# EAGLE schematic Fridge (EAGLE 9.7.0)
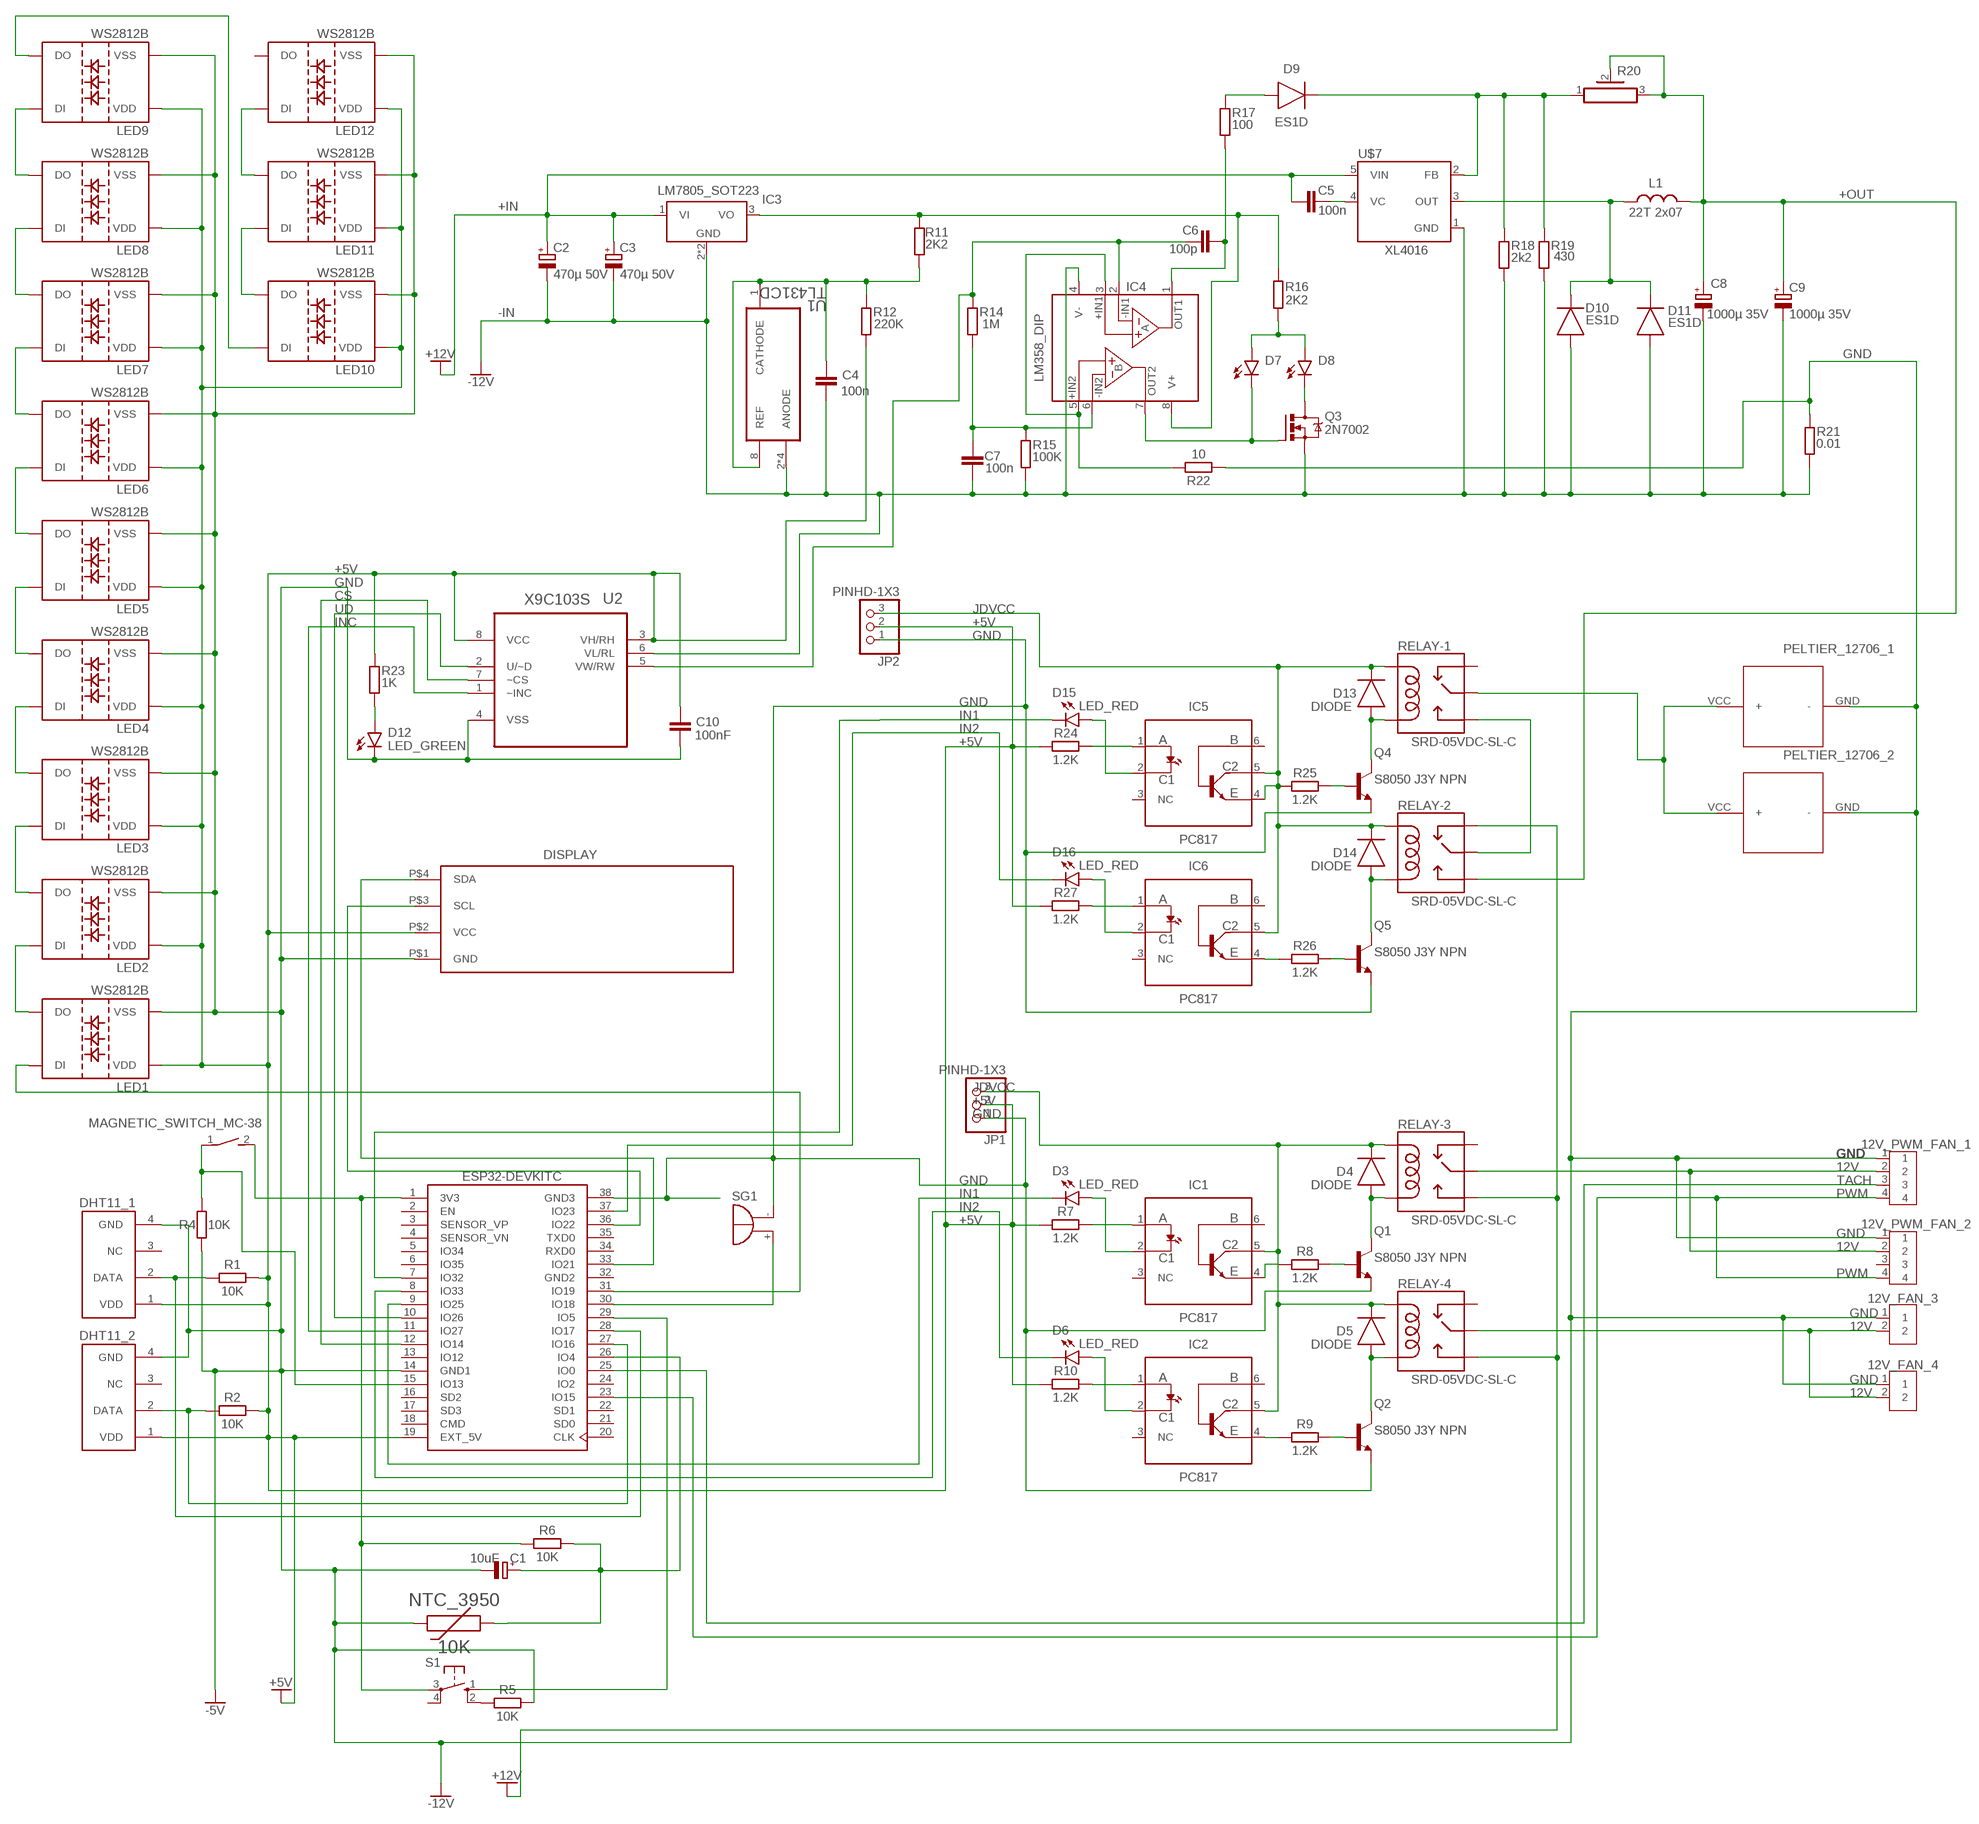
[diagram p0: schematic, sheet 1]

## Parts
12V_FAN_3  B2P-VH  [B2P-VH_396-2N]
12V_FAN_4  B2P-VH  [B2P-VH_396-2N]
12V_PWM_FAN_1  12V_FAN1  B4B-XH-A  [B4B-XH-A]
12V_PWM_FAN_2  B4B-XH-A  [B4B-XH-A]
C1  10uF  C-POL_RADIAL-11MM-DIA  [CAPPRD508W65D1000H1100B]
C2  470µ 50V  C-POL_RADIAL-20MM-DIA  [CAPPRD550W60D1200H2000B]
C3  470µ 50V  C-POL_RADIAL-20MM-DIA  [CAPPRD550W60D1200H2000B]
C4  100n  C_RADIAL-55.5MM-DIA  [CAPRD2261W240D5080H5555B]
C5  100n  C_RADIAL-55.5MM-DIA  [CAPRD2261W240D5080H5555B]
C6  100p  C_RADIAL-55.5MM-DIA  [CAPRD2261W240D5080H5555B]
C7  100n  C_RADIAL-55.5MM-DIA  [CAPRD2261W240D5080H5555B]
C8  1000µ 35V  C-POL_RADIAL-20MM-DIA  [CAPPRD550W60D1200H2000B]
C9  1000µ 35V  C-POL_RADIAL-20MM-DIA  [CAPPRD550W60D1200H2000B]
C10  100nF  C_CHIP-0402(1005-METRIC)  [CAPC1005X60]
D3  LED_RED  CHIP-FLAT-R_0402  [LEDC1005X25N_FLAT-R]
D4  DIODE  DIODE_DO-213AB(5025-METRIC)  [DIOMELF5024]
D5  DIODE  DIODE_DO-213AB(5025-METRIC)  [DIOMELF5024]
D6  LED_RED  CHIP-FLAT-R_0402  [LEDC1005X25N_FLAT-R]
D7  LED_BLUE  CHIP-FLAT-R_0402  [LEDC1005X25N_FLAT-R]
D8  LED_RED  CHIP-FLAT-R_0402  [LEDC1005X25N_FLAT-R]
D9  ES1D  DIODE_ES1D_SMA  [DIOM5226X290N]
D10  ES1D  DIODE_ES1D_SMA  [DIOM5226X290N]
D11  ES1D  DIODE_ES1D_SMA  [DIOM5226X290N]
D12  LED_GREEN  CHIP-FLAT-R_0402  [LEDC1005X25N_FLAT-R]
D13  DIODE  DIODE_DO-213AB(5025-METRIC)  [DIOMELF5024]
D14  DIODE  DIODE_DO-213AB(5025-METRIC)  [DIOMELF5024]
D15  LED_RED  CHIP-FLAT-R_0402  [LEDC1005X25N_FLAT-R]
D16  LED_RED  CHIP-FLAT-R_0402  [LEDC1005X25N_FLAT-R]
DHT11_1  DHT11  [DHT11]
IC1  PC817  4N25  [DIP762W60P254L712H480Q6B]
IC2  PC817  4N25  [DIP762W60P254L712H480Q6B]
IC3  LM7805_SOT223  [SOT230P700X170-4]
IC4  LM358_DIP  [DIP826W53P254L959H508Q8B]
IC5  PC817  4N25  [DIP762W60P254L712H480Q6B]
IC6  PC817  4N25  [DIP762W60P254L712H480Q6B]
JP1  PINHD-1X3  [1X03]
JP2  PINHD-1X3  [1X03]
L1  22T 2x07  L_RADIAL-26MM-DIA  [INDRD2743W50D3810H2616B]
LED1  WS2812B  [WS2812B]
LED2  WS2812B  [WS2812B]
LED3  WS2812B  [WS2812B]
LED4  WS2812B  [WS2812B]
LED5  WS2812B  [WS2812B]
LED6  WS2812B  [WS2812B]
LED7  WS2812B  [WS2812B]
LED8  WS2812B  [WS2812B]
LED9  WS2812B  [WS2812B]
LED10  WS2812B  [WS2812B]
LED11  WS2812B  [WS2812B]
LED12  WS2812B  [WS2812B]
MAGNETIC_SWITCH_MC-38  DS01E  [DS-01]
NTC_3950  10K  NCP_18  [THRMC1608X95]
OLED  OLED  [SIP]
PELTIER_12706_1  PELTIER  [PELTIER]
PELTIER_12706_2  PELTIER_12706_2  PELTIER  [PELTIER]
Q1  S8050 J3Y NPN  NPN_BC846A,215_SOT23-BEC  [SOT95P237X112-3N]
Q2  S8050 J3Y NPN  NPN_BC846A,215_SOT23-BEC  [SOT95P237X112-3N]
Q3  2N7002  NMOSFET_BSS123_SOT23-GSD  [SOT23]
Q4  S8050 J3Y NPN  NPN_BC846A,215_SOT23-BEC  [SOT95P237X112-3N]
Q5  S8050 J3Y NPN  NPN_BC846A,215_SOT23-BEC  [SOT95P237X112-3N]
R1  10K  R_AXIAL-7.2MM-PITCH  [RESAD724W46L381D178B]
R2  10K  R_AXIAL-7.2MM-PITCH  [RESAD724W46L381D178B]
R4  10K  R_AXIAL-7.2MM-PITCH  [RESAD724W46L381D178B]
R5  10K  R_AXIAL-7.2MM-PITCH  [RESAD724W46L381D178B]
R6  10K  R_AXIAL-7.2MM-PITCH  [RESAD724W46L381D178B]
R7  1.2K  R_AXIAL-7.2MM-PITCH  [RESAD724W46L381D178B]
R8  1.2K  R_AXIAL-7.2MM-PITCH  [RESAD724W46L381D178B]
R9  1.2K  R_AXIAL-7.2MM-PITCH  [RESAD724W46L381D178B]
R10  1.2K  R_AXIAL-7.2MM-PITCH  [RESAD724W46L381D178B]
R11  2K2  R_AXIAL-7.2MM-PITCH  [RESAD724W46L381D178B]
R12  220K  R_AXIAL-7.2MM-PITCH  [RESAD724W46L381D178B]
R14  1M  R_AXIAL-7.2MM-PITCH  [RESAD724W46L381D178B]
R15  100K  R_AXIAL-7.2MM-PITCH  [RESAD724W46L381D178B]
R16  2K2  R_AXIAL-7.2MM-PITCH  [RESAD724W46L381D178B]
R17  100  R_AXIAL-7.2MM-PITCH  [RESAD724W46L381D178B]
R18  2k2  R_AXIAL-7.2MM-PITCH  [RESAD724W46L381D178B]
R19  430  R_AXIAL-7.2MM-PITCH  [RESAD724W46L381D178B]
R20  PV36W  [PV36W]
R21  0.01  R_AXIAL-7.2MM-PITCH  [RESAD724W46L381D178B]
R22  10  R_AXIAL-7.2MM-PITCH  [RESAD724W46L381D178B]
R23  1K  R_AXIAL-7.2MM-PITCH  [RESAD724W46L381D178B]
R24  1.2K  R_AXIAL-7.2MM-PITCH  [RESAD724W46L381D178B]
R25  1.2K  R_AXIAL-7.2MM-PITCH  [RESAD724W46L381D178B]
R26  1.2K  R_AXIAL-7.2MM-PITCH  [RESAD724W46L381D178B]
R27  1.2K  R_AXIAL-7.2MM-PITCH  [RESAD724W46L381D178B]
RELAY-1  SRD-05VDC-SL-C  RELAYPTH  [SRD-05VDC-SL-C]
RELAY-2  SRD-05VDC-SL-C  RELAYPTH  [SRD-05VDC-SL-C]
RELAY-3  SRD-05VDC-SL-C  RELAYPTH  [SRD-05VDC-SL-C]
RELAY-4  SRD-05VDC-SL-C  RELAYPTH  [SRD-05VDC-SL-C]
S1  10-XX  [B3F-10XX]
SG1  EB2505  [EB2505]
U1  TL431CD  [SOIC127P599X175-8N]
U2  X9C103S  [SOIC127P600X175-8N]
U3  ESP32-DEVKITC  [MODULE_ESP32-DEVKITC]
U$2  DHT11  [DHT11]
U$7  XL4016  [LM2576T2]

## Nets
12V: 12V_FAN_3.2 12V_FAN_4.2 12V_PWM_FAN_1.2 12V_PWM_FAN_2.2 RELAY-3.SWCOMMON RELAY-4.SWCOMMON
+5V: C10.1 DHT11_1.1(VDD) JP1.2 JP2.2 LED1.1(VDD) LED2.1(VDD) LED3.1(VDD) LED4.1(VDD) LED5.1(VDD) LED6.1(VDD) LED7.1(VDD) LED8.1(VDD) LED9.1(VDD) LED10.1(VDD) LED11.1(VDD) LED12.1(VDD) OLED.P$2(VCC) R1.2 R2.2 R7.2 R10.2 R12.1 R23.2 R24.2 R27.2 U2.3(VH/RH) U2.8(VCC) U3.19(EXT_5V) U$2.1(VDD)
+12V: RELAY-2.SWCLOSED(SWCLOSE) RELAY-3.SWOPEN RELAY-4.SWOPEN
+IN: C2.1(+) C3.1(+) C5.2 IC3.1(VI) U$7.5(VIN) ; supply symbol labelled +12V
+OUT: C8.1(+) C9.1(+) L1.2 R20.2 R20.3 RELAY-2.SWOPEN
-IN: C2.2(-) C3.2(-) C4.2 C7.1 C8.2(-) C9.2(-) D10.2(A) D11.2(A) IC3.2(GND) IC3.4(GND) IC4.4(V-) Q3.2(S) R15.1 R18.1 R19.1 R21.1 U1.2(ANODE) U1.3(ANODE) U1.6(ANODE) U1.7(ANODE) U2.6(VL/RL) U$7.1(GND) ; supply symbol labelled -12V
CS: U2.7(~CS) U3.12(IO14)
GND: 12V_FAN_3.1 12V_FAN_4.1 12V_PWM_FAN_1.1 12V_PWM_FAN_2.1 C1.2(-) C10.2 D12.C DHT11_1.4(GND) JP1.1 JP2.1 LED1.3(VSS) LED2.3(VSS) LED3.3(VSS) LED4.3(VSS) LED5.3(VSS) LED6.3(VSS) LED7.3(VSS) LED8.3(VSS) LED9.3(VSS) LED10.3(VSS) LED11.3(VSS) LED12.3(VSS) NTC_3950.1 OLED.P$1(GND) PELTIER_12706_1.GND(-) PELTIER_12706_2.GND(-) Q1.2(E) Q2.2(E) Q4.2(E) Q5.2(E) R4.2 R5.2 R21.2 R22.1 SG1.- U2.4(VSS) U3.14(GND1) U3.38(GND3) U$2.4(GND) ; supply symbol labelled -5V, -12V
IN1: D3.C D15.C U3.7(IO32) U3.9(IO25)
IN2: D6.C D16.C U3.8(IO33) U3.37(IO23)
INC: U2.1(~INC) U3.11(IO27)
JDVCC: D4.1(C) D5.1(C) D13.1(C) D14.1(C) IC1.5(C2) IC2.5(C2) IC5.4(E) IC5.5(C2) IC6.5(C2) JP1.3 JP2.3 R25.1 RELAY-1.COIL1 RELAY-2.COIL1 RELAY-3.COIL1 RELAY-4.COIL1
N$1: LED1.2(DO) LED2.4(DI)
N$2: LED1.4(DI) U3.31(IO19)
N$4: LED2.2(DO) LED3.4(DI)
N$5: SG1.+ U3.30(IO18)
N$6: OLED.P$4(SDA) U3.33(IO21)
N$7: DHT11_1.2(DATA) R1.1 U3.28(IO17)
N$8: OLED.P$3(SCL) U3.36(IO22)
N$9: IC5.1(A) R24.1
N$10: MAGNETIC_SWITCH_MC-38.2 R6.1 S1.3(P) U3.1(3V3)
N$11: S1.1(S) U3.29(IO5)
N$12: R5.1 S1.2(S1)
N$14: D15.A IC5.2(C1)
N$15: C1.1(+) NTC_3950.2 R6.2 U3.26(IO4)
N$16: IC1.1(A) R7.1
N$17: D3.A IC1.2(C1)
N$18: IC2.4(E) R9.1
N$19: IC1.4(E) R8.1
N$20: Q1.1(B) R8.2
N$21: D4.2(A) Q1.3(C) RELAY-3.COIL0
N$22: Q2.1(B) R9.2
N$23: C4.1 R11.1 R12.2 U1.1(CATHODE) U1.8(REF)
N$24: D5.2(A) Q2.3(C) RELAY-4.COIL0
N$25: IC2.1(A) R10.1
N$26: D6.A IC2.2(C1)
N$27: C5.1 U$7.4(VC)
N$28: C7.2 IC4.6(-IN2) R14.1 R15.2
N$29: LED9.2(DO) LED10.4(DI)
N$30: C6.1 IC4.2(-IN1) R14.2 U2.5(VW/RW)
N$31: IC4.3(+IN1) IC4.5(+IN2) R22.2
N$32: C6.2 IC4.1(OUT1) R17.1
N$33: D7.A D8.A R16.1
N$34: D8.C Q3.3(D)
N$35: D7.C IC4.7(OUT2) Q3.1(G)
N$36: IC3.3(VO) IC4.8(V+) R11.2 R16.2
N$37: D9.2(A) R17.2
N$38: D9.1(C) R18.2 R19.2 R20.1 U$7.2(FB)
N$40: D10.1(C) D11.1(C) L1.1 U$7.3(OUT)
N$41: D12.A R23.1
N$42: Q4.1(B) R25.2
N$43: D13.2(A) Q4.3(C) RELAY-1.COIL0
N$44: R2.1 U3.27(IO16) U$2.2(DATA)
N$45: Q5.1(B) R26.2
N$46: D14.2(A) Q5.3(C) RELAY-2.COIL0
N$47: IC6.1(A) R27.1
N$48: D16.A IC6.2(C1)
N$49: IC6.4(E) R26.1
N$50: PELTIER_12706_1.VCC(+) PELTIER_12706_2.VCC(+) RELAY-1.SWCOMMON
N$51: RELAY-1.SWOPEN RELAY-2.SWCOMMON
N$52: MAGNETIC_SWITCH_MC-38.1 R4.1 U3.15(IO13)
N$53: LED3.2(DO) LED4.4(DI)
N$54: LED4.2(DO) LED5.4(DI)
N$55: LED5.2(DO) LED6.4(DI)
N$56: LED6.2(DO) LED7.4(DI)
N$57: LED7.2(DO) LED8.4(DI)
N$58: LED8.2(DO) LED9.4(DI)
N$59: LED10.2(DO) LED11.4(DI)
N$60: LED11.2(DO) LED12.4(DI)
PWM: 12V_PWM_FAN_1.4 12V_PWM_FAN_2.4 U3.23(IO15)
TACH: 12V_PWM_FAN_1.3 U3.25(IO0)
UD: U2.2(U/~D) U3.10(IO26)
Unconnected: 12V_PWM_FAN_2.3 DHT11_1.3(NC) IC1.3(NC) IC1.6(B) IC2.3(NC) IC2.6(B) IC5.3(NC) IC5.6(B) IC6.3(NC) IC6.6(B) LED12.2(DO) RELAY-1.SWCLOSED(SWCLOSE) RELAY-3.SWCLOSED(SWCLOSE) RELAY-4.SWCLOSED(SWCLOSE) S1.4(P1) U3.2(EN) U3.3(SENSOR_VP) U3.4(SENSOR_VN) U3.5(IO34) U3.6(IO35) U3.13(IO12) U3.16(SD2) U3.17(SD3) U3.18(CMD) U3.20(CLK) U3.21(SD0) U3.22(SD1) U3.24(IO2) U3.34(RXD0) U3.35(TXD0) U$2.3(NC)

## Power pins joined to a net without a drawn wire
GND2: U3.32(GND2)

## Library data of the parts
12V_FAN_3 12V_FAN_4 = Connector:B2P-VH: VH Connector Top Entry - 2POS, 3.96MM Details see: Datasheet <http://www.jst-mfg.com/product/pdf/eng/eVH.pdf>; CATEGORY: Header; DESCRIPTION: Connector Header Through Hole 2 position 0.156" (3.96mm); MANUFACTURER: JST Sales America Inc.; MPN: B2P-VH; OPERATING_TEMPERATURE: -25°C ~ 85°C; PART_STATUS: Active; PITCH: 0.156" (3.96mm); ROHS_COMPLIANCE: RoHS non-compliant; SERIES: VH; SUBCATEGORY: Rectangular Connectors; TYPE: Header, Male Pin, Board to Cable/Wire, Through Hole
12V_PWM_FAN_1 12V_PWM_FAN_2 = Connector:B4B-XH-A: XH Connector Top Entry - 4POS Details see: Datasheet <http://www.jst-mfg.com/product/pdf/eng/eXH.pdf>; CATEGORY: Header; DSECRIPTION: Connector Header Through Hole 4 position 0.098" (2.50mm); MANUFACTURER: JST Sales America Inc.; MPN: B4B-XH-A(LF)(SN); OPERATING_TEMPERATURE: -25 C to 85 C; PART_STATUS: ACTIVE; PITCH: 0.098" (2.50mm); ROHS_COMPLIANCE: ROHS3 Compliant; SERIES: XH; SPICEPREFIX: E; SUB_CATEGORY: Rectangular Connectors; TYPE: Header, Male Pin, Board to Cable/Wire, Through Hole
C1 = Capacitor:C-POL: Capacitor Polarised - Generic; CATEGORY: Capacitor
C2 C3 C8 C9 = Capacitor:C-POL: Capacitor Polarised - Generic; CATEGORY: Capacitor; SPICEPREFIX: C
C4-C7 = Tutorial - Fusion 360:C: Capacitor - Generic; CATEGORY: Capacitor
C10 = Capacitor:C: Capacitor - Generic; CATEGORY: Capacitor
D3 D6 D15 D16 = LED:CHIP-FLAT-R; CATEGORY: LED; COLOR: RED; DESCRIPTION: CHIP LED FLAT; SUB-CATEGORY: CHIP; TYPE: FLAT_TOP
D4 D5 D13 D14 = Diode:DIODE: Diode Rectifier - Generic; CATEGORY: Diode; SUB-CATEGORY: Rectifier
D7 = LED:CHIP-FLAT-R; CATEGORY: LED; COLOR: RED; DESCRIPTION: CHIP LED FLAT; SPICEPREFIX: D; SUB-CATEGORY: CHIP; TYPE: FLAT_TOP; VALUE: LED_RED
D8 = LED:CHIP-FLAT-R; CATEGORY: LED; COLOR: RED; DESCRIPTION: CHIP LED FLAT; SPICEPREFIX: D; SUB-CATEGORY: CHIP; TYPE: FLAT_TOP
D9-D11 = Diode:DIODE_: Diode Rectifier - Popular parts; CATEGORY: Diode; DESCRIPTION: DIODE GEN PURP 200V 1A SMA; MANUFACTURER: ON Semiconductor; SPICEPREFIX: D; SUB-CATEGORY: Rectifier
D12 = LED:CHIP-FLAT-R; CATEGORY: LED; COLOR: RED; DESCRIPTION: CHIP LED FLAT; SUB-CATEGORY: CHIP; TYPE: FLAT_TOP; VALUE: LED_RED
DHT11_1 U$2 = dht:DHT11
IC1 IC2 IC5 IC6 = Opto-Electronic:4N: Optocoupler, Phototransistor Output, with Base Connection Datasheet <https://www.vishay.com/docs/83725/4n25.pdf>; CATEGORY: Opto-Electronic; DESCRIPTION: Optoisolator Transistor with Base Output 5000Vrms Channel 6-DIP; MANUFACTURER: Vishay; MPN: 4N25; OPERATING_TEMP: - 55°C to + 100 °C; PART_STATUS: Active; ROHS_COMPLIANT: COMPLIANT; SERIES: 4N2x; SUB-CATEGORY: Optocoupler; THERMALLOSS: 0.150 W
IC3 = IC_Power-Management:LM7805: 5V Voltage Regulator Reference Datasheet <https://www.ti.com/lit/ds/symlink/lm340.pdf>; CATEGORY: IC_Logic; DESCRIPTION: 5V Voltage Regulator; MANUFACTURER: Generic; MPN: Generic; SERIES: LM7805; SPICEPREFIX: J; SUB-CATEGORY: Voltage Regulator; TYPE: 5V
IC4 = IC_Linear:LM358: Dual Operational Amplifier Reference Datasheet <https://www.ti.com/lit/ds/symlink/lm158-n.pdf>; CATEGORY: Amplifier; DESCRIPTION: Dual Operational Amplifier; MANUFACTURER: Generic; MPN: Generic; SERIES: LM358; SPICEPREFIX: X; SUB-CATEGORY: OpAmp; TYPE: Dual
JP1 JP2 = Connector:PINHD-1X3: PIN HEADER; CATEGORY: Headers; DESCRIPTION: Header, Straight, 3 Position; MANUFACTURER: Generic; MPN: Generic; OPERATING_TEMPERATURE: Generic; PART_STATUS: Active; PITCH: 0.100" (2.54mm); ROHS_COMPLIANCE: Generic; SERIES: Generic; SUB-CATEGORY: Headers, Male Pins; TYPE: Board to Board or Cable, Unshrouded, Through Hole, Straight
L1 = Inductor:L: Inductor Fixed - Generic; CATEGORY: Inductor; SUB-CATEGORY: Fixed
LED1-LED12 = WS2812:WS2812B
MAGNETIC_SWITCH_MC-38 = Switch:DS01E: DIL/CODE SWITCH; CATEGORY: SWITCH; TYPE: SPST
NTC_3950 = Sensor:NCP: NTC Thermistor NCP03,NCP15,NCP18 : Datasheet <https://www.mouser.in/datasheet/2/281/r44e-522712.pdf>; CATEGORY: SENSOR; DESCRIPTION: NTC Thermister; MANUFACTURER: Murata; MPN: NCP18; OPERATING_TEMPERATURE: -40℃ to 125℃; PART_STATUS: Active; ROHS_COMPLIANCE: RoHS Compliant; SERIES: NCP18; SUB-CATEGORY: Temperature; TYPE: NTC
OLED = OLED:OLED: I2C 0.91"128x32 OLED
PELTIER_12706_1 PELTIER_12706_2 = FridgePeltier:PELTIER
Q1 Q2 Q4 Q5 = Transistor:NPN_: NPN - Popular parts; CATEGORY: Transistor; DESCRIPTION: TRANS NPN 65V 0.1A SOT23; MANUFACTURER: Nexperia USA Inc.; SUB-CATEGORY: BJT; TYPE: NPN; VALUE: BC846A
Q3 = Transistor:NMOSFET_: N-Channel MOSFET - Popular parts; CATEGORY: Transistor; DESCRIPTION: MOSFET N-CH 100V 0.17A SOT-23; DRAIN_CURRENT: 170mA; MANUFACTURER: ON Semiconductor; MPN: BSS123L; OPERATING_TEMP: -55°C ~ 150°C; PART_STATUS: Active; ROHS_COMPLIANT: Yes; SPICEPREFIX: Q; SUB-CATEGORY: MOSFET; THERMALLOSS: 360mW; TYPE: N-Channel; VALUE: BSS123
R1 R2 R4-R12 R14-R19 R21-R27 = Resistor:R: Resistor Fixed - Generic; CATEGORY: Resistor; SUB-CATEGORY: Fixed
R20 = Resistor:PV36: Rectangular Trimmer Potentiometers - PV36 Series Datasheet <https://www.bourns.com/docs/Product-Datasheets/pv36.pdf>; CATEGORY: Resistor; DESCRIPTION: Lead Sealed Type Multiturn PV36 Series; MANUFACTURER: BOURNS; MPN: PV36W; OPERATING_TEMPERATURE: -55 to +125 °C; PART_STATUS: Active; ROHS_COMPLIANCE: RoHS Compliant; SERIES: PV36; SPICEPREFIX: J; SUB-CATEGORY: Trimpot; TYPE: Lead Sealed
RELAY-1-RELAY-4 = SRD-05VDC-SL-C:RELAY: SPDT relay (COM-00101)
S1 = switch-omron:10-XX: OMRON SWITCH; MPN: B3F-1000; OC_FARNELL: 176432; OC_NEWARK: 36M3542
SG1 = buzzer:EB2505: BUZZER Source: Buerklin; OC_FARNELL: unknown; OC_NEWARK: unknown
U1 = TL431CD:TL431CD: Check availability <https://pricing.snapeda.com/parts/TL431CD/Texas%20Instruments/view-part?ref=eda>; AVAILABILITY: In Stock; CHECK_PRICES: https://www.snapeda.com/parts/TL431CD/Texas+Instruments/view-part/?ref=eda; DESCRIPTION: Adjustable precision shunt regulator; MF: Texas Instruments; MP: TL431CD; PACKAGE: SOIC-8 Texas Instruments; PRICE: None; PURCHASE-URL: https://www.snapeda.com/api/url_track_click_mouser/?unipart_id=4775895&manufacturer=Texas Instruments&part_name=TL431CD&search_term=tl431; SNAPEDA_LINK: https://www.snapeda.com/parts/TL431CD/Texas+Instruments/view-part/?ref=snap; SPICEPREFIX: U
U2 = X9C103S:X9C103S: Digitally Controlled Potentiometer Check availability <https://pricing.snapeda.com/parts/X9C103S/Rochester%20Electronics%2C%20LLC/view-part?ref=eda>; AVAILABILITY: Not in stock; CHECK_PRICES: https://www.snapeda.com/parts/X9C103S/Rochester+Electronics/view-part/?ref=eda; DESCRIPTION: IC DGTL POT 10KOHM 100TAP 8SOIC; MF: Rochester Electronics, LLC; MP: X9C103S; PACKAGE: None; PRICE: None; SNAPEDA_LINK: https://www.snapeda.com/parts/X9C103S/Rochester+Electronics/view-part/?ref=snap
U3 = ESP32-DEVKITC:ESP32-DEVKITC: ESP32-DEVKITC Check availability <https://pricing.snapeda.com/parts/ESP32-DEVKITC/Espressif%20Systems/view-part?ref=eda>; AVAILABILITY: In Stock; CHECK_PRICES: https://www.snapeda.com/parts/ESP32-DEVKITC/Espressif+Systems/view-part/?ref=eda; DESCRIPTION: ESP32-WROOM-32UE series Transceiver; 802.11 b/g/n (Wi-Fi, WiFi, WLAN), Bluetooth ® Smart Ready 4.x Dual Mode Evaluation Board; MF: Espressif Systems; MP: ESP32-DEVKITC; PACKAGE: None; PRICE: None; SNAPEDA_LINK: https://www.snapeda.com/parts/ESP32-DEVKITC/Espressif+Systems/view-part/?ref=snap
U$7 = XL4016:XL4016: Check availability <https://pricing.snapeda.com/parts/XL4016/XLSEMI/view-part?ref=eda>; AVAILABILITY: Not in stock; CHECK_PRICES: https://www.snapeda.com/parts/XL4016/XLSEMI/view-part/?ref=eda; DESCRIPTION: The XL4016 is a 180 KHz fixed frequency PWM buck (step-down) DC/DC converter, capable of driving a 8A load with high efficiency, low ripple and excellent line and load regulation.; MF: XLSEMI; MP: XL4016; PACKAGE: None; PRICE: None; SNAPEDA_LINK: https://www.snapeda.com/parts/XL4016/XLSEMI/view-part/?ref=snap; SPICEPREFIX: X